# Altium schematic sheet 3-CAN.SchDoc
size A4
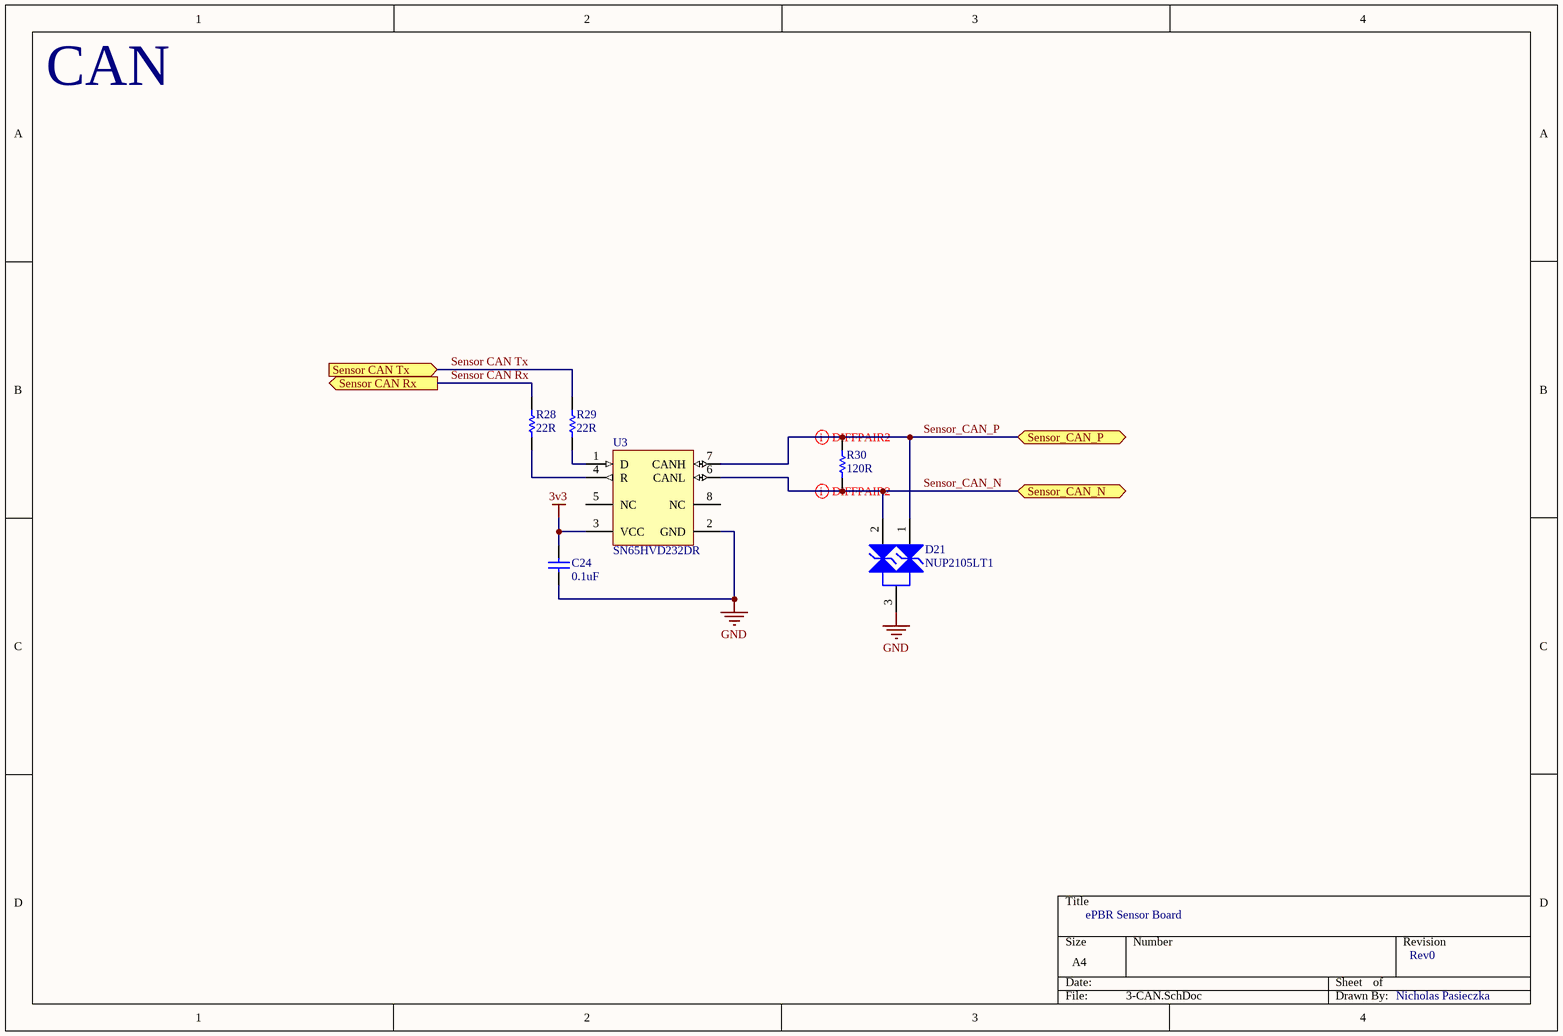
[diagram p0: 3-CAN.SchDoc]

## Parts
C24  0.1uF  [CAPC1608X90X30NL10T20]
D21  NUP2105LT1  [ONSC-SOT-23-3-318-08_V]
R28  22R  [RESC0603(1608)_N]
R29  22R  [RESC0603(1608)_N]
R30  120R  [RESC0603(1608)_N]
U3  SN65HVD232DR  [D0008A_M]

## Ports
Sensor CAN Rx (out), Sensor CAN Tx (in), Sensor_CAN_N (bidir), Sensor_CAN_P (bidir)

## Nets
3v3: C24.2 U3.3(VCC)
GND: C24.1 D21.3(K) U3.2(GND)
Sensor CAN Rx: R28.2 ; port Sensor CAN Rx
Sensor CAN Tx: R29.2 ; port Sensor CAN Tx
Sensor_CAN_N: D21.2(K) R30.1 U3.6(CANL) ; port Sensor_CAN_N
Sensor_CAN_P: D21.1(K) R30.2 U3.7(CANH) ; port Sensor_CAN_P
NetR28_1: R28.1 U3.4(R)
NetR29_1: R29.1 U3.1(D)

Not connected (* = marked no-connect by the designer): U3 5(NC) 8(NC)

## Layout directives
differential pair: Sensor_CAN_N, Sensor_CAN_P

## Notes on the sheet
- CAN
- ePBR Sensor Board
- Rev0
- Nicholas Pasieczka

## Library data of the parts
C24 = CMP-2000-06092-1: Chip Capacitor, 100 nF, +/- 10%, 50 V, -55 to 125 degC, 0603 (1608 Metric), RoHS, Tape and Reel; Manufacturer: SamsungElectro-Mechanics; Product Length: 1.6mm; Voltage: 50Vdc; Product Height: 0.8mm; Rad Hard: No; Dielectric: X7R; Packaging: Tape&Reel; Package Description: 2-Pin Surface Mount Device, Body 1.60 x 0.80 mm; Package Reference: 0603; Datasheet Version: 06/2016; Operating Temperature: -55to125°C; Category: CapacitorCeramicMultilayer; Product Depth: 0.8mm; Mounting Technology: SurfaceMount; Package/Case: 0603; Capacitance Value: 0.1uF; Tolerance: 10%; Manufacturer URL: http://www.samsungsem.com/global/index.jsp; Construction: Flat; Mounting: SurfaceMount; Datasheet URL: http://www.samsungsem.com/kr/support/product-search/mlcc/__icsFiles/afieldfile/2016/08/18/S_CL10B104KB8SFNC.pdf
D21 = CMP-1063-00165-1: Dual Line CAN Bus Protector, 3-Pin SOT-23, Tape and Reel; Manufacturer: On Semiconductor; PPK Max (W): 350; IR Max (uA): 0.1; Number of Lines: 2; V(BR) Min (V): 26.2; Direction: Bidirectional; C Max (pF): 30; PackageDescription: 3-Pin Small Outline Transistor, Body 2.92 x 1.3 mm, Pitch 0.95 mm; ComponentLink2URL: http://www.onsemi.cn/pub_link/Collateral/NUP2105L-D.PDF; ComponentLink3Description: Package Specification; ComponentLink2Description: Datasheet; ComponentLink1URL: http://www.onsemi.com/; Mounting Technology: Surface Mount; ComponentLink1Description: Manufacturer URL; Packing: Tape and Reel; PackageVersion: Rev. AP, 11/2009; PartNumber: NUP2105LT1; DatasheetVersion: Rev. 5; ComponentLink3URL: http://www.onsemi.cn/pub_link/Collateral/318-08.PDF; PackageReference: SOT-23-3-318-08
R28 R29 = CMP-1012-00034-1: 22R 0.1W 5% 0603 (1608 Metric)  SMD; Value: 22.00 Ohm; Case-EIA: 0603; Case-Metric: 1608; Technology: SMT; Power: 0.1 W; Tolerance: 5 %
R30 = CMP-1012-00052-1: 120R 0.1W 5% 0603 (1608 Metric)  SMD; Case-EIA: 0603; Value: 120.00 Ohm; Case-Metric: 1608; Technology: SMT; Power: 0.1 W; Tolerance: 5 %
U3 = CMP-0315-00075-2: 3.3 V Can Transceiver, 17 mA, -40 to 85 degC, 8-pin SOIC (D), Green (RoHS & no Sb/Br); Manufacturer: Texas Instruments; Supply Voltage(s)(V): 3.3; Receivers Per Package: 1; ICC(Max)(mA): 17; Rating: Catalog; Transient Pulse Protection(V): -25 to 25; Mounting Technology: Surface Mount; PartNumber: SN65HVD232DR; Code_JEDEC: MS-012AA; Eco-Plan: Green (RoHS & no Sb/Br); Isolated: No; SubFamily: CAN; Footprint: SN65HVD232; Drivers Per Package: 1; ComponentLink1URL: http://www.ti.com/general/docs/lit/getliterature.tsp?genericPartNumber=SN65HVD232&fileType=pdf; ComponentLink1Description: Datasheet; PackageDescription: 8-Pin Plastic Small Outline Integrated Circuit, 4.9 x 3.9 mm, Pitch 1.27 mm Pitch; PackageReference: D0008A; DatasheetVersion: SLOS346K; PackageVersion: revM, Jun-2011